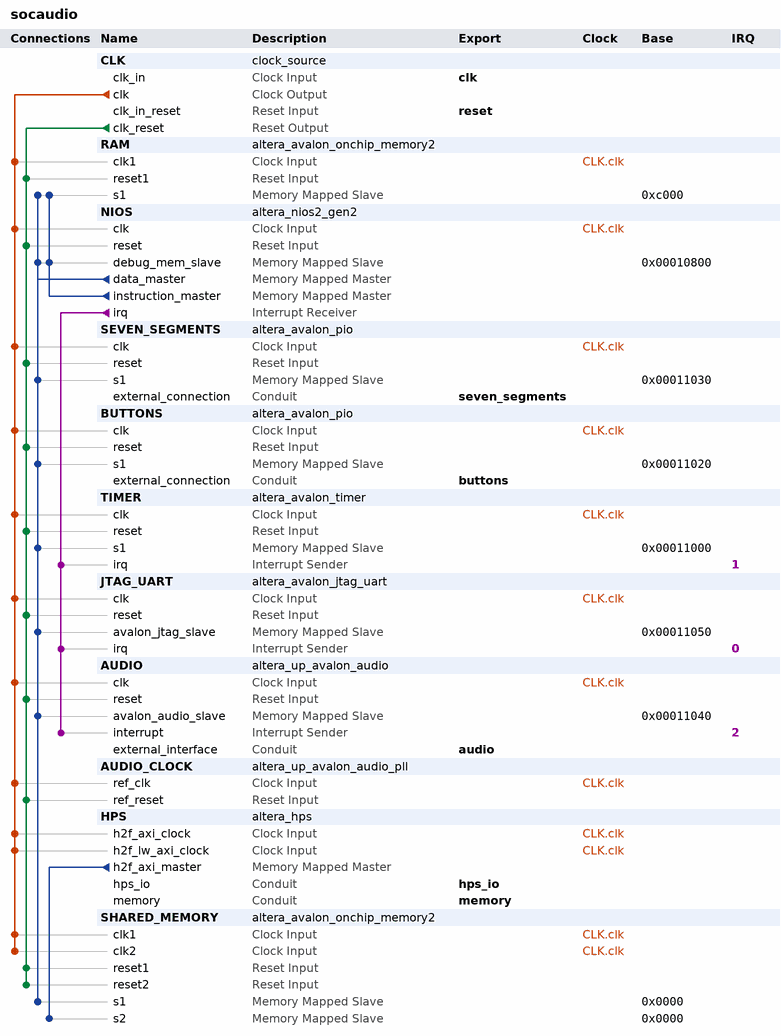
[diagram p0: system contents]
# Platform Designer (Qsys) system socaudio, Cyclone V 5CSEMA5F31C6
# Parameters at their usual value, and those the tool derives, are not listed.
package require -exact qsys 18.0
create_system socaudio
set_project_property DEVICE_FAMILY {Cyclone V}
set_project_property DEVICE 5CSEMA5F31C6

add_instance CLK clock_source 18.0
set_instance_parameter_value CLK clockFrequency 50000000

add_instance RAM altera_avalon_onchip_memory2 18.0
set_instance_parameter_value RAM dataWidth 32
set_instance_parameter_value RAM dualPort false
set_instance_parameter_value RAM initMemContent true
set_instance_parameter_value RAM initializationFileName onchip_mem.hex
set_instance_parameter_value RAM memorySize 16384

add_instance NIOS altera_nios2_gen2 18.0
set_instance_parameter_value NIOS dcache_size 2048
set_instance_parameter_value NIOS exceptionSlave RAM.s1
set_instance_parameter_value NIOS icache_size 4096
set_instance_parameter_value NIOS impl Tiny
set_instance_parameter_value NIOS resetSlave RAM.s1

add_instance SEVEN_SEGMENTS altera_avalon_pio 18.0
set_instance_parameter_value SEVEN_SEGMENTS direction Output
set_instance_parameter_value SEVEN_SEGMENTS width 28

add_instance BUTTONS altera_avalon_pio 18.0
set_instance_parameter_value BUTTONS direction Input
set_instance_parameter_value BUTTONS width 4

add_instance TIMER altera_avalon_timer 18.0
set_instance_parameter_value TIMER fixedPeriod true
set_instance_parameter_value TIMER period 1
set_instance_parameter_value TIMER periodUnits MSEC

add_instance JTAG_UART altera_avalon_jtag_uart 18.0
set_instance_parameter_value JTAG_UART simInteractiveOptions NO_INTERACTIVE_WINDOWS

add_instance AUDIO altera_up_avalon_audio 18.0
set_instance_parameter_value AUDIO audio_in false
set_instance_parameter_value AUDIO avalon_bus_type {Memory Mapped}
set_instance_parameter_value AUDIO dw 16

add_instance AUDIO_CLOCK altera_up_avalon_audio_pll 18.0
set_instance_parameter_value AUDIO_CLOCK gui_refclk 50.0

add_instance HPS altera_hps 18.0
set_instance_parameter_value HPS EMAC1_Mode N/A
set_instance_parameter_value HPS EMAC1_PinMuxing Unused
set_instance_parameter_value HPS F2SCLK_COLDRST_Enable false
set_instance_parameter_value HPS F2SCLK_DBGRST_Enable false
set_instance_parameter_value HPS F2SCLK_WARMRST_Enable false
set_instance_parameter_value HPS F2SINTERRUPT_Enable false
set_instance_parameter_value HPS F2S_Width 0
set_instance_parameter_value HPS FPGA_PERIPHERAL_OUTPUT_CLOCK_FREQ_EMAC0_GTX_CLK 125
set_instance_parameter_value HPS FPGA_PERIPHERAL_OUTPUT_CLOCK_FREQ_EMAC0_MD_CLK 2.5
set_instance_parameter_value HPS FPGA_PERIPHERAL_OUTPUT_CLOCK_FREQ_EMAC1_GTX_CLK 125
set_instance_parameter_value HPS FPGA_PERIPHERAL_OUTPUT_CLOCK_FREQ_EMAC1_MD_CLK 2.5
set_instance_parameter_value HPS HPS_PROTOCOL DDR3
set_instance_parameter_value HPS I2C0_Mode N/A
set_instance_parameter_value HPS I2C0_PinMuxing Unused
set_instance_parameter_value HPS I2C1_Mode N/A
set_instance_parameter_value HPS I2C1_PinMuxing Unused
set_instance_parameter_value HPS LWH2F_Enable true
set_instance_parameter_value HPS MEM_BANKADDR_WIDTH 3
set_instance_parameter_value HPS MEM_CLK_FREQ 400.0
set_instance_parameter_value HPS MEM_CLK_FREQ_MAX 400.0
set_instance_parameter_value HPS MEM_COL_ADDR_WIDTH 8
set_instance_parameter_value HPS MEM_DQ_WIDTH 32
set_instance_parameter_value HPS MEM_DRV_STR RZQ/6
set_instance_parameter_value HPS MEM_ROW_ADDR_WIDTH 12
set_instance_parameter_value HPS MEM_RTT_NOM {ODT Disabled}
set_instance_parameter_value HPS MEM_RTT_WR {Dynamic ODT off}
set_instance_parameter_value HPS MEM_TCL 7
set_instance_parameter_value HPS MEM_TFAW_NS 37.5
set_instance_parameter_value HPS MEM_TINIT_US 499
set_instance_parameter_value HPS MEM_TMRD_CK 3
set_instance_parameter_value HPS MEM_TRAS_NS 40.0
set_instance_parameter_value HPS MEM_TRCD_NS 15.0
set_instance_parameter_value HPS MEM_TREFI_US 7.0
set_instance_parameter_value HPS MEM_TRFC_NS 75.0
set_instance_parameter_value HPS MEM_TRP_NS 15.0
set_instance_parameter_value HPS MEM_TWTR 2
set_instance_parameter_value HPS MEM_VENDOR JEDEC
set_instance_parameter_value HPS MEM_WTCL 6
set_instance_parameter_value HPS QSPI_Mode N/A
set_instance_parameter_value HPS QSPI_PinMuxing Unused
set_instance_parameter_value HPS REF_CLK_FREQ 125.0
set_instance_parameter_value HPS S2FCLK_USER0CLK_Enable true
set_instance_parameter_value HPS S2FCLK_USER2CLK 5
set_instance_parameter_value HPS S2F_Width 2
set_instance_parameter_value HPS SDIO_Mode {4-bit Data}
set_instance_parameter_value HPS SDIO_PinMuxing {HPS I/O Set 0}
set_instance_parameter_value HPS SPIM1_Mode N/A
set_instance_parameter_value HPS SPIM1_PinMuxing Unused
set_instance_parameter_value HPS STM_Enable false
set_instance_parameter_value HPS TIMING_BOARD_AC_SKEW 0.02
set_instance_parameter_value HPS TIMING_BOARD_AC_TO_CK_SKEW 0.0
set_instance_parameter_value HPS TIMING_BOARD_DQ_TO_DQS_SKEW 0.0
set_instance_parameter_value HPS TIMING_BOARD_MAX_CK_DELAY 0.6
set_instance_parameter_value HPS TIMING_BOARD_MAX_DQS_DELAY 0.6
set_instance_parameter_value HPS TIMING_BOARD_SKEW_BETWEEN_DQS 0.02
set_instance_parameter_value HPS TIMING_BOARD_SKEW_CKDQS_DIMM_MAX 0.01
set_instance_parameter_value HPS TIMING_BOARD_SKEW_CKDQS_DIMM_MIN -0.01
set_instance_parameter_value HPS TIMING_BOARD_SKEW_WITHIN_DQS 0.02
set_instance_parameter_value HPS TIMING_TDH 125
set_instance_parameter_value HPS TIMING_TDQSCK 400
set_instance_parameter_value HPS TIMING_TDQSQ 120
set_instance_parameter_value HPS TIMING_TDS 50
set_instance_parameter_value HPS TIMING_TIH 250
set_instance_parameter_value HPS TIMING_TIS 175
set_instance_parameter_value HPS TIMING_TQSH 0.38
set_instance_parameter_value HPS UART0_Mode {No Flow Control}
set_instance_parameter_value HPS UART0_PinMuxing {HPS I/O Set 0}
set_instance_parameter_value HPS USB1_Mode N/A
set_instance_parameter_value HPS USB1_PinMuxing Unused
set_instance_parameter_value HPS desired_cfg_clk_mhz 100.0
set_instance_parameter_value HPS desired_qspi_clk_mhz 400.0

add_instance SHARED_MEMORY altera_avalon_onchip_memory2 18.0
set_instance_parameter_value SHARED_MEMORY dataWidth 32
set_instance_parameter_value SHARED_MEMORY dualPort true
set_instance_parameter_value SHARED_MEMORY initMemContent true
set_instance_parameter_value SHARED_MEMORY initializationFileName onchip_mem.hex
set_instance_parameter_value SHARED_MEMORY memorySize 32768

# connections
add_connection CLK.clk AUDIO.clk clock
add_connection CLK.clk AUDIO_CLOCK.ref_clk clock
add_connection CLK.clk BUTTONS.clk clock
add_connection CLK.clk HPS.h2f_axi_clock clock
add_connection CLK.clk HPS.h2f_lw_axi_clock clock
add_connection CLK.clk JTAG_UART.clk clock
add_connection CLK.clk NIOS.clk clock
add_connection CLK.clk RAM.clk1 clock
add_connection CLK.clk SEVEN_SEGMENTS.clk clock
add_connection CLK.clk SHARED_MEMORY.clk1 clock
add_connection CLK.clk SHARED_MEMORY.clk2 clock
add_connection CLK.clk TIMER.clk clock
add_connection CLK.clk_reset AUDIO.reset reset
add_connection CLK.clk_reset AUDIO_CLOCK.ref_reset reset
add_connection CLK.clk_reset BUTTONS.reset reset
add_connection CLK.clk_reset JTAG_UART.reset reset
add_connection CLK.clk_reset NIOS.reset reset
add_connection CLK.clk_reset RAM.reset1 reset
add_connection CLK.clk_reset SEVEN_SEGMENTS.reset reset
add_connection CLK.clk_reset SHARED_MEMORY.reset1 reset
add_connection CLK.clk_reset SHARED_MEMORY.reset2 reset
add_connection CLK.clk_reset TIMER.reset reset
add_connection HPS.h2f_axi_master SHARED_MEMORY.s2 avalon
set_connection_parameter_value HPS.h2f_axi_master/SHARED_MEMORY.s2 baseAddress 0x0000
add_connection NIOS.data_master AUDIO.avalon_audio_slave avalon
set_connection_parameter_value NIOS.data_master/AUDIO.avalon_audio_slave baseAddress 0x00011040
add_connection NIOS.data_master BUTTONS.s1 avalon
set_connection_parameter_value NIOS.data_master/BUTTONS.s1 baseAddress 0x00011020
add_connection NIOS.data_master JTAG_UART.avalon_jtag_slave avalon
set_connection_parameter_value NIOS.data_master/JTAG_UART.avalon_jtag_slave baseAddress 0x00011050
add_connection NIOS.data_master NIOS.debug_mem_slave avalon
set_connection_parameter_value NIOS.data_master/NIOS.debug_mem_slave baseAddress 0x00010800
add_connection NIOS.data_master RAM.s1 avalon
set_connection_parameter_value NIOS.data_master/RAM.s1 baseAddress 0xc000
add_connection NIOS.data_master SEVEN_SEGMENTS.s1 avalon
set_connection_parameter_value NIOS.data_master/SEVEN_SEGMENTS.s1 baseAddress 0x00011030
add_connection NIOS.data_master SHARED_MEMORY.s1 avalon
set_connection_parameter_value NIOS.data_master/SHARED_MEMORY.s1 baseAddress 0x0000
add_connection NIOS.data_master TIMER.s1 avalon
set_connection_parameter_value NIOS.data_master/TIMER.s1 baseAddress 0x00011000
add_connection NIOS.instruction_master NIOS.debug_mem_slave avalon
set_connection_parameter_value NIOS.instruction_master/NIOS.debug_mem_slave baseAddress 0x00010800
add_connection NIOS.instruction_master RAM.s1 avalon
set_connection_parameter_value NIOS.instruction_master/RAM.s1 baseAddress 0xc000
add_connection NIOS.irq AUDIO.interrupt interrupt
set_connection_parameter_value NIOS.irq/AUDIO.interrupt irqNumber 2
add_connection NIOS.irq JTAG_UART.irq interrupt
set_connection_parameter_value NIOS.irq/JTAG_UART.irq irqNumber 0
add_connection NIOS.irq TIMER.irq interrupt
set_connection_parameter_value NIOS.irq/TIMER.irq irqNumber 1

# exported interfaces
add_interface audio conduit end
set_interface_property audio EXPORT_OF AUDIO.external_interface
add_interface buttons conduit end
set_interface_property buttons EXPORT_OF BUTTONS.external_connection
add_interface clk clock sink
set_interface_property clk EXPORT_OF CLK.clk_in
add_interface hps_io conduit end
set_interface_property hps_io EXPORT_OF HPS.hps_io
add_interface memory conduit end
set_interface_property memory EXPORT_OF HPS.memory
add_interface reset reset sink
set_interface_property reset EXPORT_OF CLK.clk_in_reset
add_interface seven_segments conduit end
set_interface_property seven_segments EXPORT_OF SEVEN_SEGMENTS.external_connection

set_interconnect_requirement {$system} qsys_mm.clockCrossingAdapter HANDSHAKE
set_interconnect_requirement {$system} qsys_mm.enableEccProtection FALSE
set_interconnect_requirement {$system} qsys_mm.insertDefaultSlave FALSE
set_interconnect_requirement {$system} qsys_mm.maxAdditionalLatency 1

save_system socaudio.qsys
